# EAGLE design reduktor net (EAGLE 6.5.0)
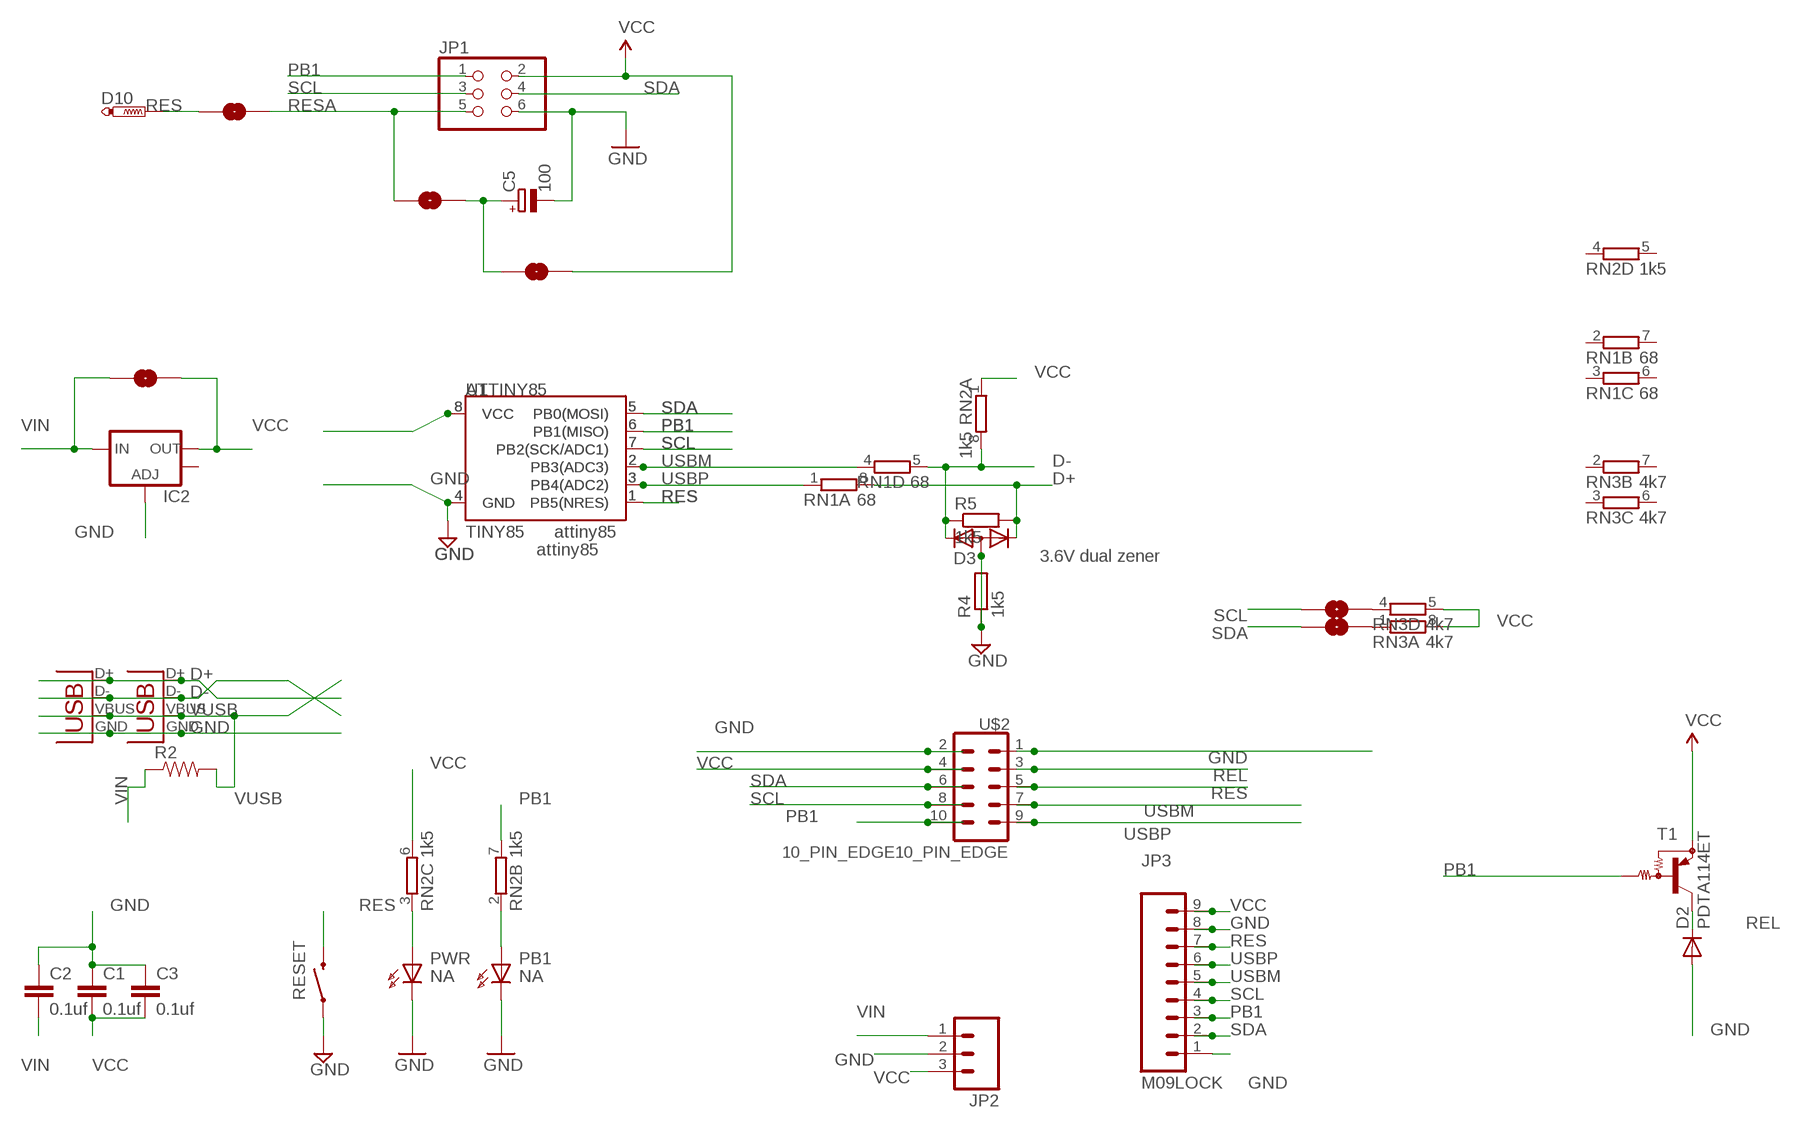
[diagram p0: schematic, sheet 1]

## Parts
ATTINY85  ATTINY45  [SO08-EIAJ]
C1  0.1uf  CAP0603-CAP  [0603-CAP]
C2  0.1uf  CAP0603-CAP  [0603-CAP]
C3  0.1uf  CAP0603-CAP  [0603-CAP]
C5  100  CPOL-EU153CLV-0405  [153CLV-0405]
D2  DIODESOD  [SOD-323]
D3  3.6V dual zener  DIODE-2CA|ACSOT23  [SOT23]
D10  PTR1TP14SQ  [TP14SQ]
FUSE1  SOLDERJUMPERNO  [SJ_2S-NO]
FUSE2  SOLDERJUMPERNO  [SJ_2S-NO]
FUSE3  SOLDERJUMPERNO  [SJ_2S-NO]
FUSE4  SOLDERJUMPERNO  [SJ_2S-NO]
FUSE5  SOLDERJUMPERNO  [SJ_2S-NO]
FUSE6  SOLDERJUMPERNO  [SJ_2S-NO]
IC2  V_REG_LM1117SOT223  [SOT223]
JP1  PINHD-2X3  [2X03]
JP2  M03LOCK  [1X03_LOCK]
JP3  M09LOCK  [1X09_LOCK]
PB1  NA  LED0603DWS  [LED-0603]
PWR  NA  LED0603DWS  [LED-0603]
R2  RESISTOR0603-RES  [0603-RES]
R4  1k5  R-EU_R0603  [R0603]
R5  1k5  R-EU_R0603  [R0603]
RESET  SWITCH-MOMENTARY-2-SMD-1101NE  [TACTILE-SWITCH-1101NE]
RN1  68  4R-N0603-ARC  [0603-ARC]
RN2  1k5  4R-N0603-ARC  [0603-ARC]
RN3  4k7  4R-N0603-ARC  [0603-ARC]
T1  PDTA114ET  ES_PNP-DRIVERSOT23-3  [ES_SOT23-3]
U1  TINY85  ATTINY45TINY45-20-DIP  [DIP08]
U$2  10_PIN_EDGE10_PIN_EDGE  [10_PIN_EDGE]
X5  USBSMD  [USB-MINIB]
X6  USB-MICROB  [USB-MICROB]

## Nets
D+: D3.1(K1) R5.2 RN1.8 X5.D+ X6.D+
D-: D3.2(K2) R5.1 RN1.5 RN2.8 X5.D- X6.D-
GND: ATTINY85.4(GND) C1.1 C2.1 C3.1 C5.- D2.2(A) D3.3(A) IC2.1(ADJ) JP1.6 JP2.2 JP3.1 JP3.8 PB1.C PWR.C R4.1 R4.2 RESET.P$1 U1.4(GND) U$2.1 U$2.2 X5.GND X6.GND
N$3 [pwr]: PWR.A RN2.3
N$8: FUSE4.2 RN3.4
N$9: FUSE5.2 RN3.1
N$10: C5.+ FUSE3.2 FUSE6.2
PB1: ATTINY85.6(PB1(MISO)) JP1.1 JP3.3 RN2.7 T1.1(B) U1.6(PB1(MISO)) U$2.10
PIN1R: PB1.A RN2.2
REL [pwr]: D2.1(C) T1.3(C) U$2.3
RES: ATTINY85.1(PB5(NRES)) D10.TP FUSE1.1 JP3.7 RESET.P$2 U1.1(PB5(NRES)) U$2.5
RESA: FUSE1.2 FUSE3.1 JP1.5
SCL: ATTINY85.7(PB2(SCK/ADC1)) FUSE4.1 JP1.3 JP3.4 U1.7(PB2(SCK/ADC1)) U$2.8
SDA: ATTINY85.5(PB0(MOSI)) FUSE5.1 JP1.4 JP3.2 U1.5(PB0(MOSI)) U$2.6
USBM: ATTINY85.2(PB3(ADC3)) JP3.5 RN1.4 U1.2(PB3(ADC3)) U$2.7
USBP: ATTINY85.3(PB4(ADC2)) JP3.6 RN1.1 U1.3(PB4(ADC2)) U$2.9
VCC [pwr]: ATTINY85.8(VCC) C1.2 C3.2 FUSE2.2 FUSE6.1 IC2.2(OUT) JP1.2 JP2.3 JP3.9 RN2.1 RN2.6 RN3.5 RN3.8 T1.2(E) U1.8(VCC) U$2.4
VIN: C2.2 FUSE2.1 IC2.3(IN) JP2.1 R2.1
VUSB: R2.2 X5.VBUS X6.VBUS
Unconnected: IC2.4(OUT) RN1.2 RN1.3 RN1.6 RN1.7 RN2.4 RN2.5 RN3.2 RN3.3 RN3.6 RN3.7

## Notes on the sheet
- attiny85
- attiny85

## Library data of the parts
ATTINY85 = SparkFun:ATTINY45: Atmel ATTiny45
C1-C3 = SparkFun:CAP: Capacitor Standard 0603 ceramic capacitor, and 0.1" leaded capacitor.
C5 = resistor:CPOL-EU: POLARIZED CAPACITOR, European symbol
D2 = SparkFun:DIODE: Diode These are standard reverse protection diodes and small signal diodes. SMA package can handle up to about 1A. SOD-323 can handle about 200mA. What the SOD-323 package when ordering, there are some mfgs out there that are 5-pin packages.
D3 = diode:DIODE-2CA|AC: Dual DIODE Cathode-Anode|Anode-Cathode
D10 = testpad:PTR1: TEST PIN
FUSE1-FUSE6 = SparkFun:SOLDERJUMPER: Solder Jumper Standard SMD solder jumper. Used to automate production. Two varients : Normally Open and Normally Closed are the same, but have different paste layers. NC will have a large amount of paste and should jumper during reflow.
IC2 = SparkFun:V_REG_LM1117: Voltage Regulator LM1117 Standard adjustable voltage regulator but in SMD form. Spark Fun Electronics SKU : COM-00595
JP1 = pinhead:PINHD-2X3: PIN HEADER
JP2 = SparkFun:M03: Header 3 Standard 3-pin 0.1" header. Use with straight break away headers (SKU : PRT-00116), right angle break away headers (PRT-00553), swiss pins (PRT-00743), machine pins (PRT-00117), and female headers (PRT-00115). Molex polarized connector foot print use with SKU : PRT-08232 with associated crimp pins and housings.
JP3 = SparkFun:M09: Header 9 Standard 9-pin 0.1" header. Use with straight break away headers (SKU : PRT-00116), right angle break away headers (PRT-00553), swiss pins (PRT-00743), machine pins (PRT-00117), and female headers (PRT-00115).
PB1 PWR = DOUBLE-SIDE:LED
R2 = SparkFun:RESISTOR: Resistor Basic schematic elements and footprints for 0603, 1206, and PTH resistors.
R4 R5 = resistor:R-EU_: RESISTOR, European symbol
RESET = SparkFun:SWITCH-MOMENTARY-2
RN1-RN3 = resistor-dil:4R-N: Array Chip Resistor Source: RS Component / Phycomp; OC_FARNELL: unknown; OC_NEWARK: unknown
T1 = pnp_digital_transistor:ES_PNP-DRIVER
U1 = SparkFun-DigitalIC:ATTINY45: Atmel 8-pin 2/4/8kB flash uC; PROD_ID: IC-09439; VALUE: TINY45-20-DIP
U$2 = eclibrary:10_PIN_EDGE
X5 X6 = SparkFun:USB: USB Connectors USB-B-PTH is fully proven SKU : PRT-00139 USB-miniB is fully proven SKU : PRT-00587 USB-A-PCB is untested. USB-A-H is throughly reviewed, but untested. Spark Fun Electronics SKU : PRT-00437 USB-B-SMT is throughly reviewed, but untested. Needs silkscreen touching up. USB-A-S has not been used/tested USB-MB-H has not been used/tested

## Net classes
0 default: width 0.203 mm, drill 0.356 mm, clearance 0.203 mm
1 GND: width 0.203 mm, drill 0.356 mm, clearance 0.203 mm
2 pwr: width 0.203 mm, drill 0.356 mm, clearance 0.203 mm

## Board
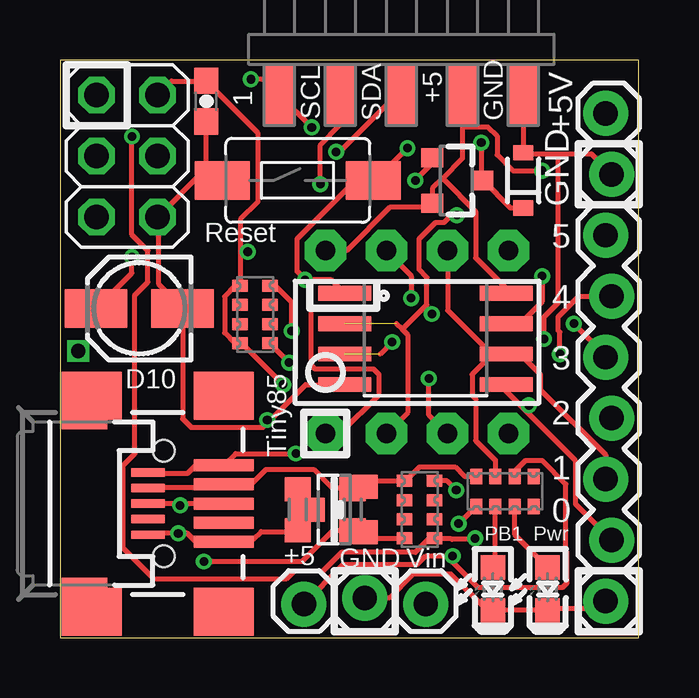
[diagram p1: board, top side]
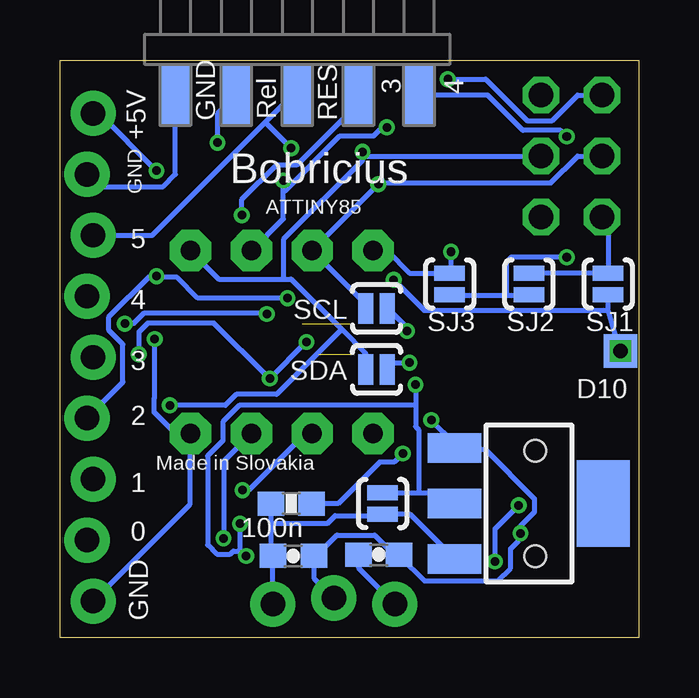
[diagram p2: board, bottom side, seen from below]

Size 24.11 x 24.07 mm. Coordinates in mm from the lower left corner, seen from the top.
Outline: 0,24.07 0,0 24.11,0 24.11,24.07 0,24.07
Copper layers (1*16): Top 0.035mm / dielectric 1.5mm / Bottom 0.035mm
Design rules "ITEADstudio_DRC": minimum track width 6mil, minimum drill 12mil, track to track 6mil, track to pad 6mil, pad to pad 6mil, via to via 6mil, smd to smd 0mil, copper to edge 10mil, drill to drill 10mil, minimum pad ring 10mil, minimum via ring 6mil, stop-mask expansion 2mil, vias tented up to drill 100mil, thermal gap 10mil

### Footprints (pad centres in the part's own frame; a part is rotated, then mirrored left to right if it is on the bottom)
SO08-EIAJ = smd 0.61 x 2.21: 1 -1.905,-3.378; 2 -0.635,-3.378; 3 0.635,-3.378; 4 1.905,-3.378; 5 1.905,3.353; 6 0.635,3.353; 7 -0.635,3.353; 8 -1.905,3.353
0603-CAP = smd 1.1 x 1: 1 -0.85,0; 2 0.85,0
153CLV-0405 = smd 2.6 x 1.6: + 1.8,0; - -1.8,0
SOD-323 = smd 0.63 x 0.83: 1 -1.15,0; 2 1.15,0
SOT23 = smd 1 x 1.4: 1 -0.95,-1.1; 2 0.95,-1.1; 3 0,1.1
TP14SQ = smd 1.4 x 1.4: TP 0,0
SJ_2S-NO = smd 0.635 x 1.27: 1 -0.45,0; 2 0.45,0
SOT223 = smd 1.219 x 2.235: 1 -2.311,-3.099; 2 0,-3.099; 3 2.311,-3.099 | smd 3.6 x 2.2: 4 0,3.099
2X03 = drill 1.016 octagon: 1 -2.54,-1.27; 2 -2.54,1.27; 3 0,-1.27; 4 0,1.27; 5 2.54,-1.27; 6 2.54,1.27
1X03_LOCK = drill 1.016 pad 1.88: 1 0,0.127; 2 2.54,-0.127; 3 5.08,0.127
1X09_LOCK = drill 1.016 pad 1.88: 1 0,0.127; 2 2.54,-0.127; 3 5.08,0.127; 4 7.62,-0.127; 5 10.16,0.127; 6 12.7,-0.127; 7 15.24,0.127; 8 17.78,-0.127; 9 20.32,0.127
LED-0603 = smd 1.016 x 1.016: A 0.889,0; C -0.889,0
0603-RES = smd 1.1 x 1: 1 -0.85,0; 2 0.85,0
R0603 = smd 1 x 1.1: 1 -0.85,0; 2 0.85,0
TACTILE-SWITCH-1101NE = smd 2.3 x 1.6: P$1 -3.15,0; P$2 3.15,0
0603-ARC = smd 0.5 x 0.65: 1 -1.2,-0.625; 2 -0.4,-0.625; 3 0.4,-0.625; 4 1.2,-0.625; 5 1.2,0.625; 6 0.4,0.625; 7 -0.4,0.625; 8 -1.2,0.625
ES_SOT23-3 = smd 0.8 x 0.9: 1 -0.95,-1; 2 0.95,-1; 3 0,1.1
DIP08 = drill 0.813 pad 1.727 octagon: 1 -3.81,-3.81; 2 -1.27,-3.81; 3 1.27,-3.81; 4 3.81,-3.81; 5 3.81,3.81; 6 1.27,3.81; 7 -1.27,3.81; 8 -3.81,3.81
10_PIN_EDGE = smd 1.27 x 2.54: 1 5.08,0; 3 2.54,0; 5 0,0; 7 -2.54,0; 9 -5.08,0 | smd 1.27 x 2.54 bottom: 2 5.08,0; 4 2.54,0; 6 0,0; 8 -2.54,0; 10 -5.08,0
USB-MINIB = smd 2.5 x 0.5: D+ 2.5,0; D- 2.5,0.8; GND 2.5,-1.6; ID 2.5,-0.8; VBUS 2.5,1.6 | smd 2.5 x 2: MTN1 -3,4.5; MTN2 2.5,4.5; MTN3 -3,-4.5; MTN4 2.5,-4.5 | hole 0.9: 0,2.2; 0,-2.2
USB-MICROB = smd 0.35 x 1.4: D+ 0,2.65; D- -0.65,2.65; GND 1.3,2.65; ID 0.65,2.65; VBUS -1.3,2.65 | smd 1.8 x 1.9: MT1 -4,0; MT2 4,0

### Placement (x,y rotation side)
ATTINY85  15.24,12.45 270 top
C1  10.83,3.46 180 bottom
C2  14.39,3.41 180 bottom
C3  6.1,22.36 90 top
C5  3.3,13.72 180 top
D2  19.3,19.05 90 top
D3  11.43,5.34 90 top
D10  0.76,11.94 0 bottom
FUSE1  1.27,14.74 90 bottom
FUSE2  10.67,5.59 90 bottom
FUSE3  4.57,14.74 270 bottom
FUSE4  10.92,13.72 0 bottom
FUSE5  10.92,11.18 0 bottom
FUSE6  7.87,14.74 270 bottom
IC2  4.57,5.59 270 bottom
JP1  2.79,20.07 270 top
JP2  15.24,1.53 180 top
JP3  22.86,1.53 90 top
PB1  18.03,2.04 90 top
PWR  20.32,2.04 90 top
R2  14.48,5.59 0 bottom
R4  9.91,5.34 90 top
R5  12.19,5.34 270 top
RESET  9.91,19.05 0 top
RN1  14.99,5.34 90 top
RN2  18.54,6.1 0 top
RN3  8.13,13.47 90 top
T1  16.51,19.05 270 top
U1  14.87,12.32 0 top
U$2  14.22,22.61 180 bottom
X5  4.32,5.59 0 top
X6  1.02,5.59 270 top

### Tracks (layer width: path | path; a pad name or v marks a point on that pad's centre or on a via)
D+  (via drill 0.36)
  Top 0.203: RN1.8 14.35,4.14 12.78,4.14 12.55,4.37 R5.2 D3.1 12.09,4.47 11.38,4.47 10.08,3.18 v5.99,3.18 | X5.D+ 5,5.59 | 5,5.59 X6.D+ | v5,5.52 5,5.59
  Bottom 0.203: v5.99,3.18 5.99,4.53 v5,5.52
D-
  Top 0.203: RN2.8 17.32,6.74 16.84,6.74 16.46,7.12 14.99,7.12 14.45,6.58 RN1.5 14.35,6.53 12.78,6.53 12.55,6.3 D3.2 12.47,6.2 12.19,6.2 R5.1 12.12,6.25 11.33,6.25 10.57,7.01 8.58,7.01 8,6.43 6.91,6.43 X5.D- 6.81,6.38 6.68,6.25 3.68,6.25 X6.D-
GND  (via drill 0.36)
  Top 0.203: C3.1 6.1,19.69 6.73,19.05 RESET.P$1 6.1,19.56 JP1.6 4.12,17.45 4.12,14.74 5.05,13.8 C5.- 5.1,9.12 5.46,8.77 8.46,8.77 8.7,9.01 | R4.2 9.91,5.06 D3.3 10.31,5.34 9.91,4.93 R4.1 9.83,4.42 8.38,4.42 8.05,4.09 6.88,4.09 X5.GND 6.81,4.02 5.64,4.02 5.31,4.35 v4.93,4.35 4.12,4.35 4.06,4.3 3.68,4.3 X6.GND | ATTINY85.4 10.24,10.54 8.7,9.01 | v8.64,9.07 8.7,9.01 | U$2.1 D2.2 19.38,20.15 20.75,20.15 | 20.75,20.15 22.15,20.15 JP3.8 | JP3.1 22.4,1.2 20.4,1.2 PWR.C PB1.C 17.96,1.2 17.73,1.2 16.28,2.65 14.71,2.65 13.72,1.66 JP2.2 | 20.75,20.15 20.75,13.95 20.17,13.36 v20.17,12.45
  Bottom 0.203: v8.64,9.07 7.67,8.11 IC2.1 7.59,7.85 6.4,7.85 4.34,5.79 4.34,5.24 4.93,4.65 v4.93,4.35 4.98,4.53 4.98,4.07 5.33,3.71 5.33,2.9 5.87,2.37 8.91,2.37 9.93,3.38 C1.1 9.98,3.48 10.21,3.48 11,4.27 12.57,4.27 13.41,3.43 C2.1 13.51,3.41 13.51,2.47 JP2.2 | U$2.1 19.3,19.31 19.81,18.8 22.48,18.8 JP3.8 | JP3.1 18.69,5.57 18.69,8.49 U1.4 18.77,7.98 20.19,9.4 20.19,9.96 20.17,9.99 v20.17,12.45
N$3
  Top 0.203: PWR.A 18.95,4.3 RN2.3
N$8  (via drill 0.36)
  Top 0.203: v9.65,12.78 9.65,13.97 8.97,14.66 RN3.4
  Bottom 0.203: v9.65,12.78 9.65,12.91 10.46,13.72 FUSE4.2
N$9  (via drill 0.36)
  Top 0.203: v9.55,11.46 8.76,12.25 RN3.1
  Bottom 0.203: v9.55,11.46 10.18,11.46 10.46,11.18 FUSE5.2
N$10  (via drill 0.36)
  Top 0.203: v3,15.85 3,15.19 1.52,13.72 C5.+
  Bottom 0.203: 5.51,14.28 FUSE6.2 | 5.51,14.28 FUSE3.2 | 5.51,14.28 5.51,15.65 5.31,15.85 v3,15.85
PB1  (via drill 0.36)
  Top 0.203: ATTINY85.6 18.01,11.81 17.17,10.98 17.17,10.11 17.32,9.96 17.32,8.21 18.14,7.39 18.14,6.74 RN2.7 | v14.81,19.05 15.49,19.74 15.49,19.99 T1.1 | v10.49,21.26 U$2.10 9.07,22.66 8.46,23.27 v7.95,23.27 | ATTINY85.6 17.93,11.87 16.15,13.64 16.15,16.11 U1.6 | JP3.3 22.73,7.62 20.02,10.34 20.02,10.98 19.18,11.81 ATTINY85.6
  Bottom 0.203: 14.81,18.62 14.81,17.45 16.13,16.13 U1.6 | 14.81,18.62 v14.81,19.05 | v10.49,21.26 10.69,21.26 11.05,20.91 12.45,20.91 14.73,18.62 14.81,18.62 | JP1.1 2.54,22.61 3.61,21.54 4.65,21.54 6.38,23.27 v7.95,23.27
PIN1R
  Top 0.203: PB1.A 18.14,3.03 RN2.2
REL  (via drill 0.36)
  Top 0.203: D2.1 19.3,17.91 18.77,17.91 17.63,19.05 T1.3 17.55,19.13 v17.55,20.63
  Bottom 0.203: v17.55,20.63 17.55,21.82 U$2.3
RES  (via drill 0.36, 0.6)
  Top 0.203: v10.21,14.91 11.3,14.91 ATTINY85.1 | v10.21,14.91 10.16,14.99 9.88,15.27 9.88,16.62 12.32,19.05 RESET.P$2 13.16,19.08 v14.48,20.4 | U1.1 11.68,8.51 13.28,10.11 13.28,10.98 13.06,11.21 10.62,11.21 10.44,11.38 10.44,14.84 v10.21,14.91
  Bottom 0.203: U$2.5 14.43,22.61 15.56,21.48 | 15.56,21.48 20.27,16.77 JP3.7 | D10.TP 1.27,13.64 | 1.27,13.64 FUSE1.1 | 1.27,13.64 8.94,13.64 v10.21,14.91 | v14.48,20.4 15.56,21.48
  other vias: 0.76,11.94
RESA
  Bottom 0.203: JP1.5 1.27,17.28 FUSE1.2 1.35,15.19 FUSE3.1
SCL  (via drill 0.36)
  Top 0.203: ATTINY85.7 19.18,13.09 20.09,14 v20.09,15.07 | U$2.8 11.68,21.36 10.85,20.53 v10.85,18.9 | v14.63,14.15 14.63,15.09 13.61,16.11 U1.7
  Bottom 0.203: JP3.4 21.49,10.65 21.49,12.22 22.07,12.81 22.07,13.36 20.37,15.07 v20.09,15.07 20.02,15.02 19.23,15.02 18.36,14.15 v14.63,14.15 | FUSE4.1 11.38,13.9 13.59,16.11 U1.7 13.54,16.21 v10.85,18.9 10.77,18.95 3.66,18.95 2.54,20.07 JP1.3
SDA  (via drill 0.36)
  Top 0.203: ATTINY85.5 18.59,10.27 19.37,9.49 | 19.37,9.49 21.49,7.37 21.49,5.57 JP3.2 | U$2.6 14.02,22.61 11.66,20.25 v11.51,20.25 | 19.37,9.49 19.53,9.66 v19.53,9.68
  Bottom 0.203: 12.38,12.84 14.48,14.94 14.78,14.94 | 12.38,12.84 11.38,11.84 FUSE5.1 | 14.78,14.94 17.5,14.94 18.67,16.11 U1.5 | 14.78,14.94 14.78,16.62 11.51,19.89 v11.51,20.25 11.43,20.07 JP1.4 | v19.53,9.68 17.22,9.68 16.76,10.14 15.09,10.14 12.38,12.84
USBM  (via drill 0.36)  (1 unrouted)
  Top 0.203: v16.51,6.15 16.13,6.53 RN1.4 | 14.26,12.84 14.5,12.6 14.5,9.4 U1.2 | 14.26,12.84 14.02,13.09 | v16.54,17.61 16.31,17.61 16,17.3 15.65,17.3 14.96,16.62 14.96,15.35 15.29,15.02 15.29,13.87 15.2,13.78 | 14.26,12.84 15.2,13.78 | JP3.5 22.73,11.76 v21.41,13.09 | 15.2,13.78 v15.49,13.49
  Bottom 0.203: v16.51,6.15 16.26,6.15 13.92,8.49 13.61,8.49 U1.2 | U$2.7 11.68,22.25 14.22,19.71 15.09,19.71 16.54,18.27 v16.54,17.61 | v21.41,13.09 21.06,13.09 20.62,13.52 15.52,13.52 v15.49,13.49
USBP  (via drill 0.36)  (1 unrouted)
  Top 0.203: v17.3,4.14 17.25,4.09 16.33,4.09 16.31,4.12 15.62,4.12 RN1.1 15.52,4.12 15.37,4.12 14.81,3.56 11.73,3.56 10.95,2.77 9.75,2.77 9.42,2.44 3.94,2.44 2.64,3.74 2.64,7.19 3.12,7.67 3.12,14.28 3.66,14.81 3.66,16.13 3,16.79 v3,20.88 | v13.84,12.32 13.34,11.81 | v15.37,10.8 15.37,9.28 16.13,8.51 U1.3 | JP3.6 21.62,14.23 20.75,13.36 20.75,12.81 20.83,12.73 v20.83,11.81
  Bottom 0.203: v17.3,4.14 17.3,7.34 16.15,8.49 U1.3 | v13.84,12.32 v15.37,10.8 15.44,10.85 17.7,13.11 20.45,13.11 20.83,12.73 v20.83,11.81 | U$2.9 6.3,22.61 4.83,21.14 3.25,21.14 v3,20.88
VCC  (via drill 0.36)
  Top 0.203: 15.94,19.14 16.76,19.97 16.76,21.29 | 15.94,19.14 15.52,18.72 15.52,18.11 T1.2 15.42,18.06 15.29,17.94 13.74,17.94 11.94,16.13 U1.8 | U$2.4 16.76,21.29 | ATTINY85.8 18.59,14.56 17.32,15.83 17.32,17.76 15.94,19.14 | v20.09,19.46 18.87,19.46 18.21,20.12 18.21,20.91 17.83,21.29 16.76,21.29 | v16.61,4.75 17.32,5.46 RN2.1 | JP2.3 11.81,3.05 14.88,3.05 15.24,3.41 v16.36,3.41 16.18,3.33 17.4,2.11 20.95,2.11 21.13,2.29 21.13,3.56 21.08,3.61 21.08,6.41 20.12,7.37 19.38,7.37 18.95,6.94 18.95,6.74 RN2.6 | JP1.2 4.65,23.19 6.1,23.19 C3.2 6.15,23.12 8.23,21.04 8.23,18.14 7.52,17.43 7.52,16.08 | 7.52,16.08 7.52,14.76 RN3.5 7.49,14.66 7.29,14.66 6.86,14.23 6.86,12.7 7.29,12.27 7.49,12.27 RN3.8 7.59,12.25 v9.3,10.54 | 7.52,16.08 v7.82,16.08
  Bottom 0.203: U1.8 11.05,16.11 10.46,16.11 9.55,15.19 FUSE6.1 7.82,15.27 v7.82,16.08 | JP3.9 22.48,21.85 v20.09,19.46 | 16.61,3.66 v16.61,4.75 | v16.36,3.41 16.61,3.66 | JP2.3 11.66,2.9 11.66,3.46 C1.2 | 9.17,6.02 8.1,6.02 IC2.2 | 9.17,6.02 10.67,6.02 FUSE2.2 | 9.17,6.02 9.17,8.66 9.3,8.79 9.3,9.68 | v9.3,10.54 9.3,9.68 | 9.3,9.68 16.64,9.68 17.32,9 17.32,8.21 17.96,7.57 17.96,3.87 17.58,3.48 17.02,3.48 16.89,3.61 16.69,3.61 16.61,3.66
VIN
  Bottom 0.203: IC2.3 9.52,5.13 FUSE2.1 10.74,5.08 12.65,5.08 12.95,4.78 15.32,4.78 | JP2.1 C2.2 15.32,3.46 15.32,4.78 | 15.32,4.78 R2.1
VUSB  (via drill 0.36)
  Top 0.203: v9.83,7.67 7.31,7.67 6.83,7.19 X5.VBUS 6.73,7.14 5.61,7.14 5.31,6.84 4.12,6.84 4.06,6.89 3.68,6.89 X6.VBUS
  Bottom 0.203: R2.2 12.52,5.59 10.79,7.32 10.18,7.32 v9.83,7.67

### Text on the board
tNames: +5 | 1 | SCL | SDA | GND | +5V | GND | Reset | 5 | 4 | D10 | 3 | 2 | Tiny85 | 1 | 0 | PB1 | Pwr | +5 | GND | Vin
bNames: 4 | 3 | RES | Rel | GND | +5V | Bobricius | GND | ATTINY85 | 5 | SJ1 | SJ2 | SJ3 | SCL | 4 | SDA | D10 | 3 | 2 | Made in Slovakia | 1 | 100n | 0 | GND